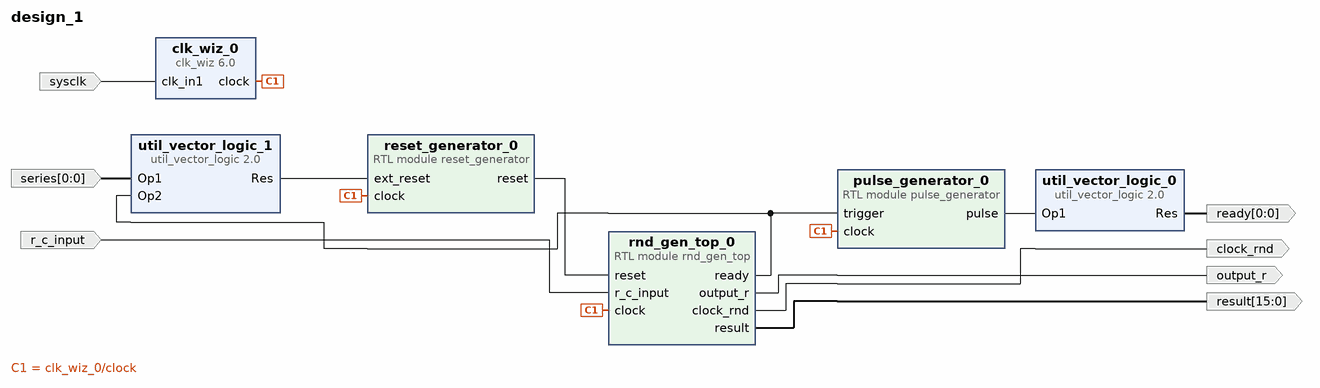
[diagram p0: block diagram of the top level]
# Vivado block design design_1, xc7a15tcpg236-1, Vivado 2020.2
create_bd_design design_1

create_bd_port -dir I -type clk sysclk
create_bd_port -dir I r_c_input
create_bd_port -dir O output_r
create_bd_port -dir O -type clk clock_rnd
create_bd_port -dir O -from 0 -to 0 ready
create_bd_port -dir I -from 0 -to 0 series
create_bd_port -dir O -from 15 -to 0 result

create_bd_cell -type ip -vlnv xilinx.com:ip:clk_wiz:6.0 clk_wiz_0
set_property -dict [list \
  CONFIG.CLKIN1_JITTER_PS 833.33 \
  CONFIG.CLKOUT1_JITTER 522.315 \
  CONFIG.CLKOUT1_PHASE_ERROR 668.310 \
  CONFIG.CLKOUT1_REQUESTED_OUT_FREQ 50 \
  CONFIG.CLK_IN1_BOARD_INTERFACE sys_clock \
  CONFIG.CLK_OUT1_PORT clock \
  CONFIG.MMCM_CLKFBOUT_MULT_F 62.500 \
  CONFIG.MMCM_CLKIN1_PERIOD 83.333 \
  CONFIG.MMCM_CLKIN2_PERIOD 10.0 \
  CONFIG.MMCM_CLKOUT0_DIVIDE_F 15.000 \
  CONFIG.USE_LOCKED false \
  CONFIG.USE_RESET false \
] [get_bd_cells clk_wiz_0]
create_bd_cell -type module -reference reset_generator reset_generator_0
create_bd_cell -type ip -vlnv xilinx.com:ip:util_vector_logic:2.0 util_vector_logic_0
set_property -dict {CONFIG.C_OPERATION not CONFIG.C_SIZE 1} [get_bd_cells util_vector_logic_0]
create_bd_cell -type ip -vlnv xilinx.com:ip:util_vector_logic:2.0 util_vector_logic_1
set_property -dict {CONFIG.C_OPERATION and CONFIG.C_SIZE 1} [get_bd_cells util_vector_logic_1]
create_bd_cell -type module -reference rnd_gen_top rnd_gen_top_0
create_bd_cell -type module -reference pulse_generator pulse_generator_0

# ---- connections ----

connect_bd_net [get_bd_pins clk_wiz_0/clock] \
  [get_bd_pins reset_generator_0/clock] [get_bd_pins rnd_gen_top_0/clock] [get_bd_pins pulse_generator_0/clock]
connect_bd_net -net clk_in1_0_1 [get_bd_ports sysclk] [get_bd_pins clk_wiz_0/clk_in1]
connect_bd_net [get_bd_pins rnd_gen_top_0/ready] [get_bd_pins util_vector_logic_1/Op2] [get_bd_pins pulse_generator_0/trigger]
connect_bd_net -net r_c_input_0_1 [get_bd_ports r_c_input] [get_bd_pins rnd_gen_top_0/r_c_input]
connect_bd_net [get_bd_pins rnd_gen_top_0/output_r] [get_bd_ports output_r]
connect_bd_net [get_bd_pins rnd_gen_top_0/clock_rnd] [get_bd_ports clock_rnd]
connect_bd_net [get_bd_pins reset_generator_0/reset] [get_bd_pins rnd_gen_top_0/reset]
connect_bd_net [get_bd_pins util_vector_logic_0/Res] [get_bd_ports ready]
connect_bd_net [get_bd_pins pulse_generator_0/pulse] [get_bd_pins util_vector_logic_0/Op1]
connect_bd_net -net Op1_0_1 [get_bd_ports series] [get_bd_pins util_vector_logic_1/Op1]
connect_bd_net [get_bd_pins util_vector_logic_1/Res] [get_bd_pins reset_generator_0/ext_reset]
connect_bd_net [get_bd_pins rnd_gen_top_0/result] [get_bd_ports result]

validate_bd_design
save_bd_design
